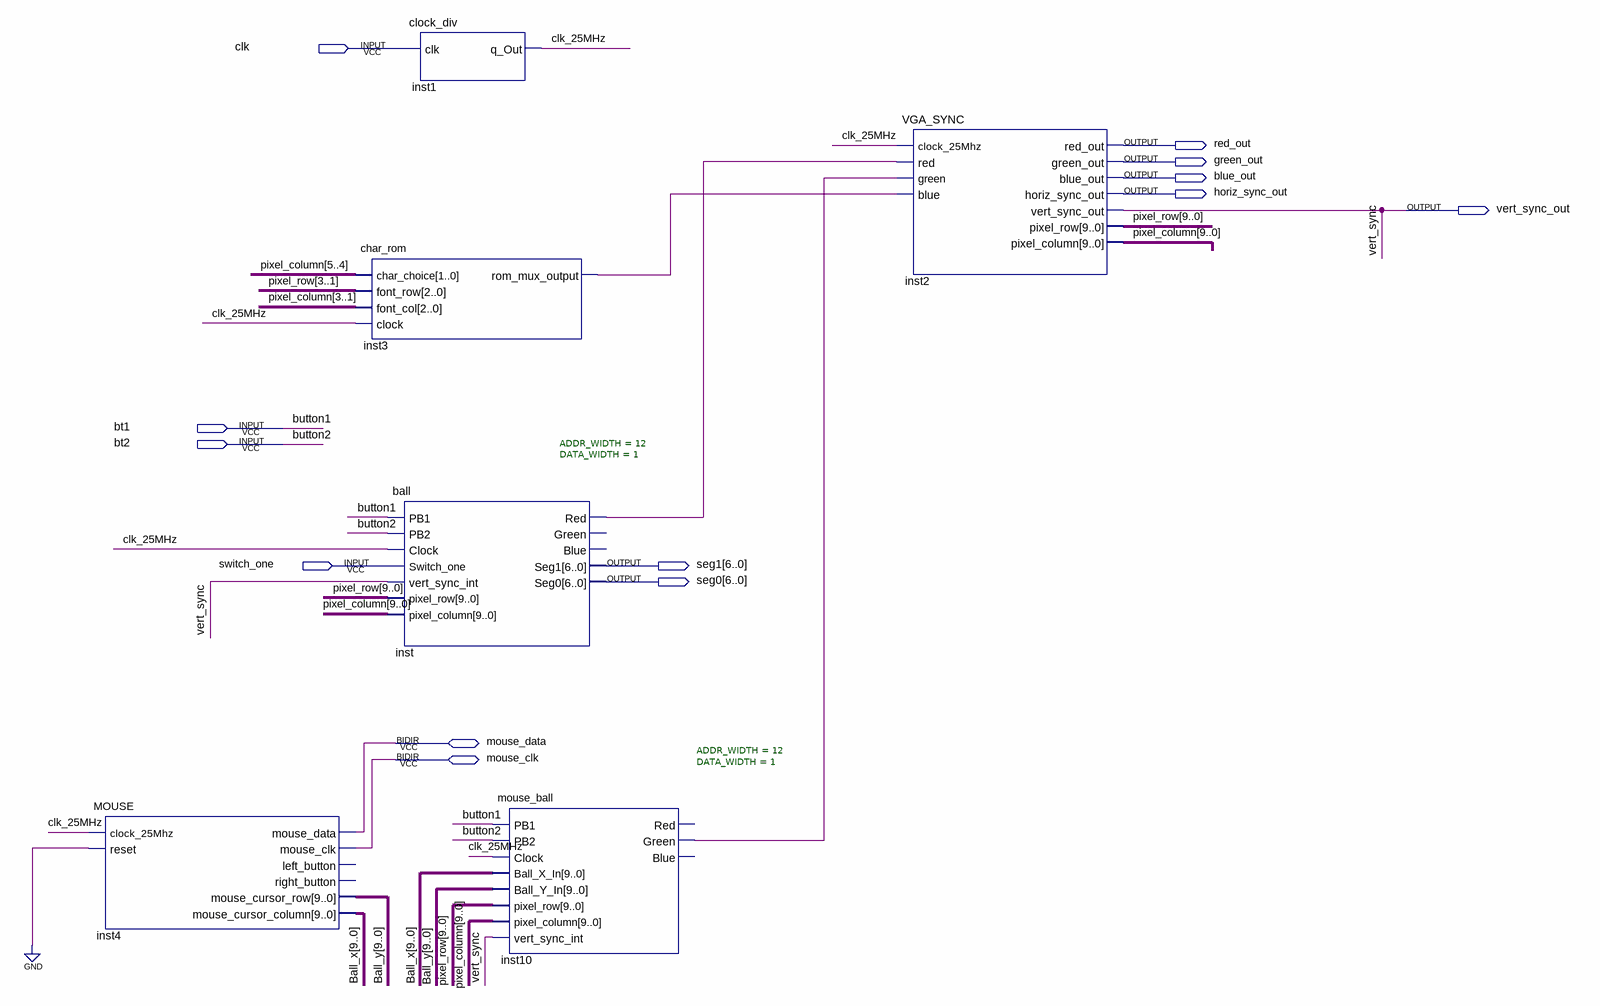
[diagram p0: schematic sheet]
// Quartus schematic Diagram.bdf as structural Verilog: 6 symbols, 13 pins
module Diagram (
  input  clk,
  input  bt1,
  input  bt2,
  input  switch_one,
  inout  mouse_data,
  inout  mouse_clk,
  output red_out,
  output green_out,
  output blue_out,
  output horiz_sync_out,
  output vert_sync_out,
  output [6:0] seg1,
  output [6:0] seg0
);

  wire clk_25MHz, inst3_rom_mux_output, inst10_green, inst_red;
  wire [9:0] Ball_x, Ball_y, pixel_column, pixel_row;

  MOUSE inst4 (
    .clock_25Mhz(clk_25MHz), .reset(1'b0), .mouse_cursor_row(Ball_y), .mouse_cursor_column(Ball_x),
    .mouse_data(mouse_data), .mouse_clk(mouse_clk));  // open: left_button, right_button
  clock_div inst1 (.clk(clk), .q_Out(clk_25MHz));
  char_rom inst3 (
    .char_choice(pixel_column[5:4]), .font_row(pixel_row[3:1]), .font_col(pixel_column[3:1]),
    .clock(clk_25MHz), .rom_mux_output(inst3_rom_mux_output));
  ball #(.ADDR_WIDTH(12), .DATA_WIDTH(1)) inst (
    .PB1(bt1), .PB2(bt2), .Clock(clk_25MHz), .Switch_one(switch_one), .vert_sync_int(vert_sync_out),
    .pixel_row(pixel_row), .pixel_column(pixel_column), .Red(inst_red), .Seg1(seg1), .Seg0(seg0));  // open: Green, Blue
  mouse_ball #(.ADDR_WIDTH(12), .DATA_WIDTH(1)) inst10 (
    .PB1(bt1), .PB2(bt2), .Clock(clk_25MHz), .Ball_X_In(Ball_x), .Ball_Y_In(Ball_y), .pixel_row(pixel_row),
    .pixel_column(pixel_column), .vert_sync_int(vert_sync_out), .Green(inst10_green));  // open: Red, Blue
  VGA_SYNC inst2 (
    .clock_25Mhz(clk_25MHz), .red(inst_red), .green(inst10_green), .blue(inst3_rom_mux_output),
    .red_out(red_out), .green_out(green_out), .blue_out(blue_out), .horiz_sync_out(horiz_sync_out),
    .vert_sync_out(vert_sync_out), .pixel_row(pixel_row), .pixel_column(pixel_column));

  // Other names for the same wires on the sheet: button1 = bt1; button2 = bt2; vert_sync = vert_sync_out
endmodule
